# Altium schematic sheet A3000_BigROMs.SchDoc: ARM2 to ARM3 Adapter
size A3; DocumentNumber: 1; SheetNumber: 2; SheetTotal: 5
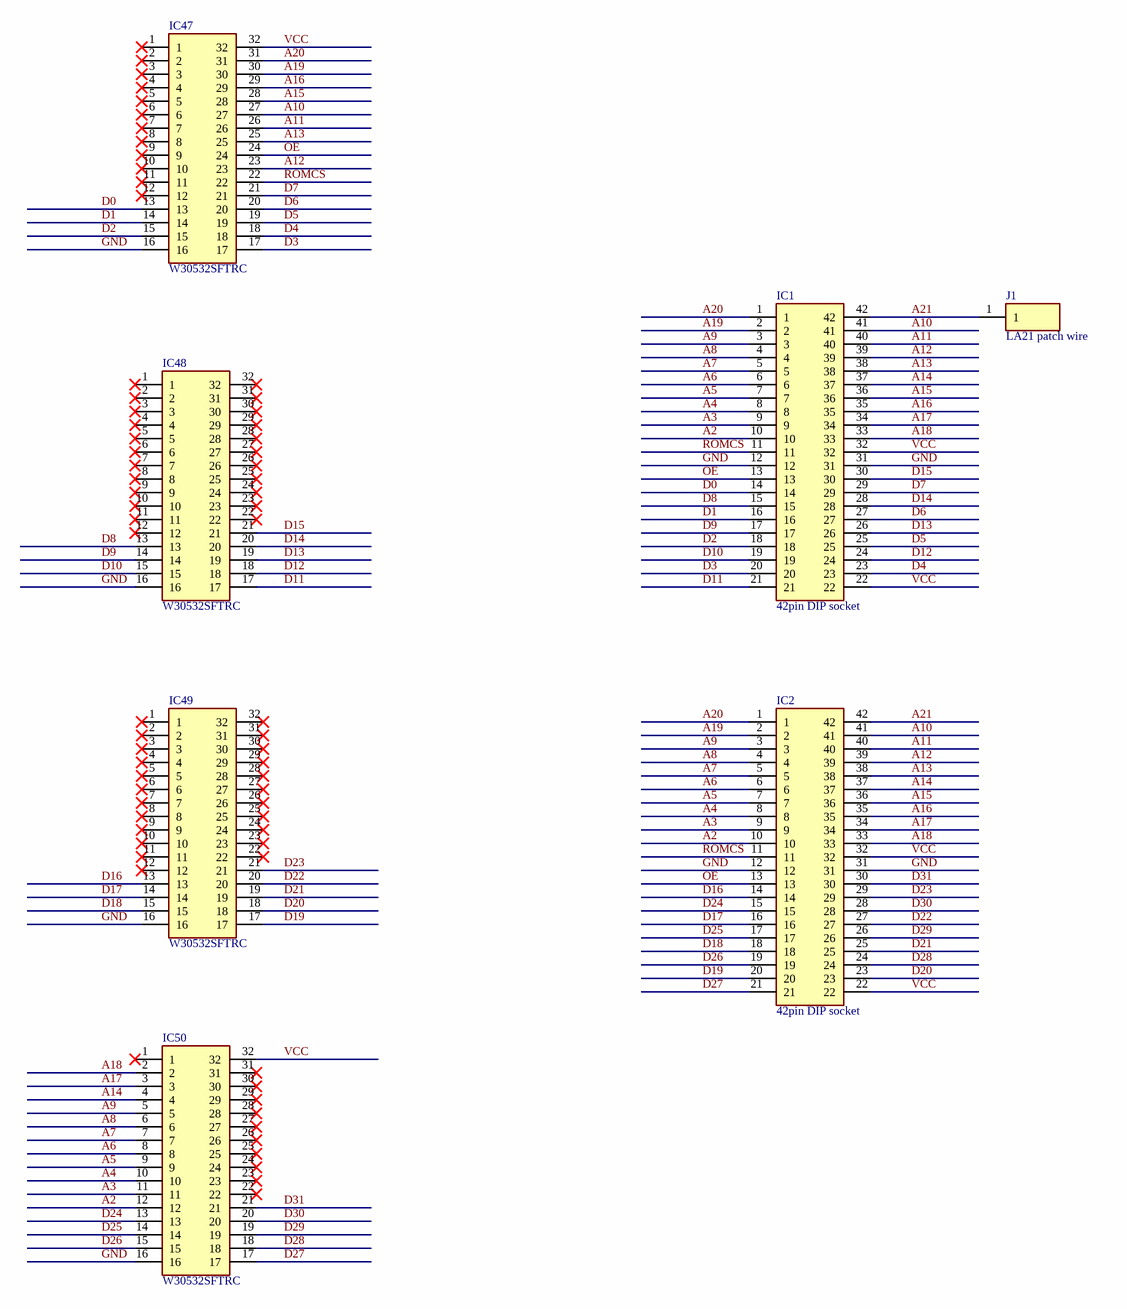
[diagram p0: A3000_BigROMs.SchDoc]

## Parts
IC1  42pin DIP socket  [DIPS1524W50P254L5330H420Q42N]
IC2  42pin DIP socket  [DIPS1524W50P254L5330H420Q42N]
IC47  W30532SFTRC  [DIPS1524W55P254L4056H350Q32N]
IC48  W30532SFTRC  [DIPS1524W55P254L4056H350Q32N]
IC49  W30532SFTRC  [DIPS1524W55P254L4056H350Q32N]
IC50  W30532SFTRC  [DIPS1524W55P254L4056H350Q32N]
J1  LA21 patch wire  [TSW-101-XX-YY-S]

## Nets
A2: IC1.10 IC2.10 IC50.12
A3: IC1.9 IC2.9 IC50.11
A4: IC1.8 IC2.8 IC50.10
A5: IC1.7 IC2.7 IC50.9
A6: IC1.6 IC2.6 IC50.8
A7: IC1.5 IC2.5 IC50.7
A8: IC1.4 IC2.4 IC50.6
A9: IC1.3 IC2.3 IC50.5
A10: IC1.41 IC2.41 IC47.27
A11: IC1.40 IC2.40 IC47.26
A12: IC1.39 IC2.39 IC47.23
A13: IC1.38 IC2.38 IC47.25
A14: IC1.37 IC2.37 IC50.4
A15: IC1.36 IC2.36 IC47.28
A16: IC1.35 IC2.35 IC47.29
A17: IC1.34 IC2.34 IC50.3
A18: IC1.33 IC2.33 IC50.2
A19: IC1.2 IC2.2 IC47.30
A20: IC1.1 IC2.1 IC47.31
A21: IC1.42 IC2.42 J1.1
D0: IC1.14 IC47.13
D1: IC1.16 IC47.14
D2: IC1.18 IC47.15
D3: IC1.20 IC47.17
D4: IC1.23 IC47.18
D5: IC1.25 IC47.19
D6: IC1.27 IC47.20
D7: IC1.29 IC47.21
D8: IC1.15 IC48.13
D9: IC1.17 IC48.14
D10: IC1.19 IC48.15
D11: IC1.21 IC48.17
D12: IC1.24 IC48.18
D13: IC1.26 IC48.19
D14: IC1.28 IC48.20
D15: IC1.30 IC48.21
D16: IC2.14 IC49.13
D17: IC2.16 IC49.14
D18: IC2.18 IC49.15
D19: IC2.20 IC49.17
D20: IC2.23 IC49.18
D21: IC2.25 IC49.19
D22: IC2.27 IC49.20
D23: IC2.29 IC49.21
D24: IC2.15 IC50.13
D25: IC2.17 IC50.14
D26: IC2.19 IC50.15
D27: IC2.21 IC50.17
D28: IC2.24 IC50.18
D29: IC2.26 IC50.19
D30: IC2.28 IC50.20
D31: IC2.30 IC50.21
GND: IC1.12 IC1.31 IC2.12 IC2.31 IC47.16 IC48.16 IC49.16 IC50.16
OE: IC1.13 IC2.13 IC47.24
ROMCS: IC1.11 IC2.11 IC47.22
VCC: IC1.22 IC1.32 IC2.22 IC2.32 IC47.32 IC50.32

Not connected (* = marked no-connect by the designer): IC47 1* 2* 3* 4* 5* 6* 7* 8* 9* 10* 11* 12*; IC48 1* 2* 3* 4* 5* 6* 7* 8* 9* 10* 11* 12* 22* 23* 24* 25* 26* 27* 28* 29* 30* 31* 32*; IC49 1* 2* 3* 4* 5* 6* 7* 8* 9* 10* 11* 12* 22* 23* 24* 25* 26* 27* 28* 29* 30* 31* 32*; IC50 1* 22* 23* 24* 25* 26* 27* 28* 29* 30* 31*

## Notes on the sheet
- SIZE
- CODION LTD
- DIMENSIONS
- TITLE
- VARIANT
- REVISION
- DATE
- A3
- SHEET
- OF
- FILE
- DRAWN BY

## Library data of the parts
IC1 IC2 = 110-87-642-41-001101: Connector; Manufacturer_Name: Preci-Dip; Datasheet Link: http://www.precidip.com/AppHost/9698,1/Scripts/Modules/Catalog/Default.aspx?c=14&i=121&p=23&pdf=1&dsku=110-PP-XXX-41-001101; Height: 4.2mm; Manufacturer_Part_Number: 110-87-642-41-001101; Mouser Part Number: 437-1108764241001101; Mouser Price/Stock: https://www.mouser.com/Search/Refine.aspx?Keyword=437-1108764241001101
IC47-IC50 = W30532SFTRC: Connector; Manufacturer_Name: Winslow; Height: 3.5mm; Manufacturer_Part_Number: W30532SFTRC
J1 = TSW-101-07-G-S: Connector; Manufacturer_Name: SAMTEC; Datasheet Link: http://suddendocs.samtec.com/prints/tsw-xxx-xx-xxx-x-xx-xxx-mkt.pdf; Manufacturer_Part_Number: TSW-101-07-G-S; Mouser Part Number: 200-TSW10107GS; Mouser Price/Stock: https://www.mouser.co.uk/ProductDetail/Samtec/TSW-101-07-G-S?qs=hzq9O0YpnZscfPe5oPvABA%3D%3D; Arrow Part Number: TSW-101-07-G-S; Arrow Price/Stock: https://www.arrow.com/en/products/tsw-101-07-g-s/samtec?region=europe